# Altium schematic sheet CC2540.SchDoc
size A4
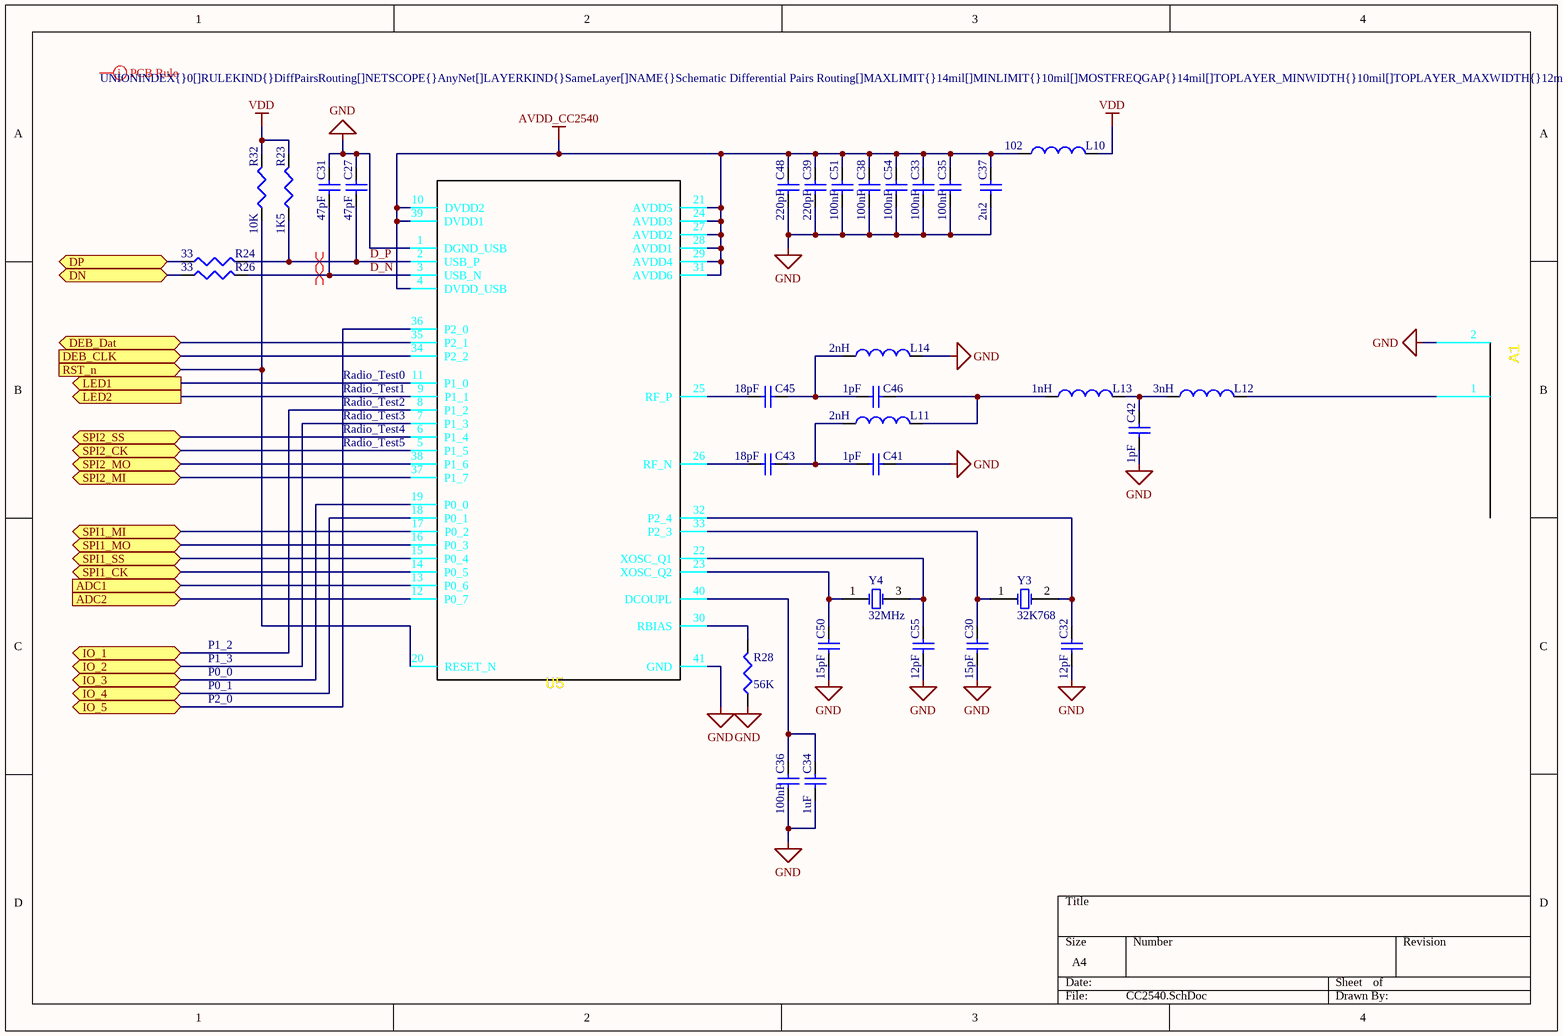
[diagram p0: CC2540.SchDoc]

## Parts
A1  Antenna_IIFA_1  [antenna_IIFA_1]  (value not drawn)
C27  value 47pF  [0402]  (hidden comment: Cap)
C30  value 15pF  [0402]  (hidden comment: Cap)
C31  value 47pF  [0402]  (hidden comment: Cap)
C32  value 12pF  [0402]  (hidden comment: Cap)
C33  value 100nF  [0402]  (hidden comment: Cap)
C34  value 1uF  [C0805]  (hidden comment: Cap)
C35  value 100nF  [0402]  (hidden comment: Cap)
C36  value 100nF  [0402]  (hidden comment: Cap)
C37  value 2u2  [C0805]  (hidden comment: Cap)
C38  value 100nF  [0402]  (hidden comment: Cap)
C39  value 220pF  [0402]  (hidden comment: Cap)
C41  value 1pF  [0402]  (hidden comment: Cap)
C42  value 1pF  [0402]  (hidden comment: Cap)
C43  value 18pF  [0402]  (hidden comment: Cap)
C45  value 18pF  [0402]  (hidden comment: Cap)
C46  value 1pF  [0402]  (hidden comment: Cap)
C48  value 220pF  [0402]  (hidden comment: Cap)
C50  value 15pF  [0402]  (hidden comment: Cap)
C51  value 100nF  [0402]  (hidden comment: Cap)
C54  value 100nF  [0402]  (hidden comment: Cap)
C55  value 12pF  [0402]  (hidden comment: Cap)
L10  value 102  [0402-A]  (hidden comment: Inductor)
L11  value 2nH  [0402-A]  (hidden comment: Inductor)
L12  value 3nH  [0402-A]  (hidden comment: Inductor)
L13  value 1nH  [0402-A]  (hidden comment: Inductor)
L14  value 2nH  [0402-A]  (hidden comment: Inductor)
R23  value 1K5  [J1-0603]  (hidden comment: Res3)
R24  value 33  [J1-0603]  (hidden comment: Res3)
R26  value 33  [J1-0603]  (hidden comment: Res3)
R28  value 56K  [J1-0603]  (hidden comment: Res3)
R32  value 10K  [J1-0603]  (hidden comment: Res3)
U5  CC2540  [QFN40_RHA (DATASHEET)]  (value not drawn)
Y3  32K768  [xtal_3215]
Y4  32MHz  [xtal_3225]

## Ports
ADC1 (in), ADC2 (in), DEB_CLK (in), DEB_Dat (bidir), DN (bidir), DP (bidir), IO_1 (bidir), IO_2 (bidir), IO_3 (bidir), IO_4 (bidir), IO_5 (bidir), LED1 (out), LED2 (out), RST_n (in), SPI1_CK (bidir), SPI1_MI (bidir), SPI1_MO (bidir), SPI1_SS (bidir), SPI2_CK (bidir), SPI2_MI (bidir), SPI2_MO (bidir), SPI2_SS (bidir)

## Nets
AVDD_CC2540: C33.2 C35.2 C37.2 C38.2 C39.2 C48.2 C51.2 C54.2 L10.1 U5.4(DVDD_USB) U5.10(DVDD2) U5.21(AVDD5) U5.24(AVDD3) U5.27(AVDD2) U5.28(AVDD1) U5.29(AVDD4) U5.31(AVDD6) U5.39(DVDD1)
GND: A1.2 C27.2 C30.1 C31.2 C32.1 C33.1 C34.1 C35.1 C36.1 C37.1 C38.1 C39.1 C41.1 C42.1 C48.1 C50.1 C51.1 C54.1 C55.1 L14.2 R28.1 U5.1(DGND_USB) U5.41(GND)
VDD: L10.2 R23.2 R32.2
ADC1: U5.13(P0_6) ; port ADC1
ADC2: U5.12(P0_7) ; port ADC2
D_N: C31.1 R26.2 U5.3(USB_N)
D_P: C27.1 R23.1 R24.2 U5.2(USB_P)
DEB_CLK: U5.34(P2_2) ; port DEB_CLK
DEB_Dat: U5.35(P2_1) ; port DEB_Dat
DN: R26.1 ; port DN
DP: R24.1 ; port DP
IO_1: U5.8(P1_2) ; port IO_1
IO_2: U5.7(P1_3) ; port IO_2
IO_3: U5.19(P0_0) ; port IO_3
IO_4: U5.18(P0_1) ; port IO_4
IO_5: U5.36(P2_0) ; port IO_5
LED1: U5.11(P1_0) ; port LED1
LED2: U5.9(P1_1) ; port LED2
RST_n: R32.1 U5.20(RESET_N) ; port RST_n
SPI1_CK: U5.14(P0_5) ; port SPI1_CK
SPI1_MI: U5.17(P0_2) ; port SPI1_MI
SPI1_MO: U5.16(P0_3) ; port SPI1_MO
SPI1_SS: U5.15(P0_4) ; port SPI1_SS
SPI2_CK: U5.5(P1_5) ; port SPI2_CK
SPI2_MI: U5.37(P1_7) ; port SPI2_MI
SPI2_MO: U5.38(P1_6) ; port SPI2_MO
SPI2_SS: U5.6(P1_4) ; port SPI2_SS
NetA1_1: A1.1 L12.2
NetC30_2: C30.2 U5.33(P2_3) Y3.1(OSC1)
NetC32_2: C32.2 U5.32(P2_4) Y3.2(OSC2)
NetC34_2: C34.2 C36.2 U5.40(DCOUPL)
NetC41_2: C41.2 C43.1 L11.1
NetC42_2: C42.2 L12.1 L13.2
NetC43_2: C43.2 U5.26(RF_N)
NetC45_1: C45.1 C46.2 L14.1
NetC45_2: C45.2 U5.25(RF_P)
NetC46_1: C46.1 L11.2 L13.1
NetC50_2: C50.2 U5.23(XOSC_Q2) Y4.1(OSC1)
NetC55_2: C55.2 U5.22(XOSC_Q1) Y4.3(OSC2)
NetR28_2: R28.2 U5.30(RBIAS)

## Layout directives
differential pair: D_N, D_P
rule Undefined; rule Differential Pairs Routing [Pref Gap = 14mil    Min Gap  = 10mil    Max Gap  = 14milPref Width = 12mil    Min Width  = 10mil    Max Width  = 12mil]: (no net found under the mark)

## Notes on the sheet
- (near U5) Radio_Test0
- (near U5) Radio_Test1
- (near U5) Radio_Test2
- (near U5) Radio_Test3
- (near U5) Radio_Test4
- (near U5) Radio_Test5
- P1_2
- P1_3
- P0_0
- P0_1
- P2_0

## Library data of the parts
A1 = Antenna_IIFA_1: Antenna single ended IIFA, 2450 MHz
C27 C31 = Cap: Capacitor; Manufacturer: FARNELL; RS: 624-2238; Order N: 1758959; Published: 8-Jun-2000; LatestRevisionDate: 17-Jul-2002; LatestRevisionNote: Re-released for DXP Platform.; PackageReference: RAD-0.3; Publisher: Altium Limited; PackageDescription: Radial Cap, Thru-Hole; 2 Leads; 0.3 in Pin Spacing; FARNELL: 1758959
C30 C50 = Cap: Capacitor; Manufacturer: FARNELL; RS: 788-0266; Order N: 2218840; Published: 8-Jun-2000; LatestRevisionDate: 17-Jul-2002; LatestRevisionNote: Re-released for DXP Platform.; PackageReference: RAD-0.3; Publisher: Altium Limited; PackageDescription: Radial Cap, Thru-Hole; 2 Leads; 0.3 in Pin Spacing; FARNELL: 2218840
C32 C55 = Cap: Capacitor; Manufacturer: FARNELL; RS: 788-0263; Order N: 2210762; Published: 8-Jun-2000; LatestRevisionDate: 17-Jul-2002; LatestRevisionNote: Re-released for DXP Platform.; PackageReference: RAD-0.3; Publisher: Altium Limited; PackageDescription: Radial Cap, Thru-Hole; 2 Leads; 0.3 in Pin Spacing; FARNELL: 2210762
C33 C35 C36 C38 C51 C54 = Cap: Capacitor; Manufacturer: FARNELL; RS: 788-2843; Order N: 2309011; Published: 8-Jun-2000; LatestRevisionDate: 17-Jul-2002; LatestRevisionNote: Re-released for DXP Platform.; PackageReference: RAD-0.3; Publisher: Altium Limited; PackageDescription: Radial Cap, Thru-Hole; 2 Leads; 0.3 in Pin Spacing; FARNELL: 2309011
C34 = Cap: Capacitor; Manufacturer: FARNELL; RS: 653-0490; Order N: 2320857; Published: 8-Jun-2000; LatestRevisionDate: 17-Jul-2002; LatestRevisionNote: Re-released for DXP Platform.; PackageReference: RAD-0.3; Publisher: Altium Limited; PackageDescription: Radial Cap, Thru-Hole; 2 Leads; 0.3 in Pin Spacing; FARNELL: 2320857
C37 = Cap: Capacitor; Manufacturer: FARNELL; RS: 749-2138; Order N: 1759416; Published: 8-Jun-2000; LatestRevisionDate: 17-Jul-2002; LatestRevisionNote: Re-released for DXP Platform.; PackageReference: RAD-0.3; Publisher: Altium Limited; PackageDescription: Radial Cap, Thru-Hole; 2 Leads; 0.3 in Pin Spacing; FARNELL: 1759416
C39 C48 = Cap: Capacitor; Manufacturer: FARNELL; RS: 624-2941; Order N: 2426879; Published: 8-Jun-2000; LatestRevisionDate: 17-Jul-2002; LatestRevisionNote: Re-released for DXP Platform.; PackageReference: RAD-0.3; Publisher: Altium Limited; PackageDescription: Radial Cap, Thru-Hole; 2 Leads; 0.3 in Pin Spacing; FARNELL: 2426879
C41 C42 C46 = Cap: Capacitor; Manufacturer: FARNELL; RS: 788-0279; Order N: 1611944; Published: 8-Jun-2000; LatestRevisionDate: 17-Jul-2002; LatestRevisionNote: Re-released for DXP Platform.; PackageReference: RAD-0.3; Publisher: Altium Limited; PackageDescription: Radial Cap, Thru-Hole; 2 Leads; 0.3 in Pin Spacing; FARNELL: 1611944
C43 C45 = Cap: Capacitor; Manufacturer: FARNELL; RS: 788-0260; Order N: 1758947; Published: 8-Jun-2000; LatestRevisionDate: 17-Jul-2002; LatestRevisionNote: Re-released for DXP Platform.; PackageReference: RAD-0.3; Publisher: Altium Limited; PackageDescription: Radial Cap, Thru-Hole; 2 Leads; 0.3 in Pin Spacing; FARNELL: 1758947
L10 L13 = Inductor: Manufacturer: FARNELL; Code_IEC: 1005; RS: 777-6861; Order N: 1669624; Published: 8-Jun-2000; LatestRevisionDate: 29-May-2009; LatestRevisionNote: IPC-7351 Footprint Added.; PackageReference: 0402-A; Publisher: Altium Limited; PackageDescription: Chip Inductor; Code_JEITA: 0402; FARNELL: 1669624
L11 L14 = Inductor: Manufacturer: FARNELL; Code_IEC: 1005; RS: 777-6978; Order N: 2103067; Published: 8-Jun-2000; LatestRevisionDate: 29-May-2009; LatestRevisionNote: IPC-7351 Footprint Added.; PackageReference: 0402-A; Publisher: Altium Limited; PackageDescription: Chip Inductor; Code_JEITA: 0402; FARNELL: 2103067
L12 = Inductor: Manufacturer: FARNELL; Code_IEC: 1005; RS: 777-6987; Order N: 2103077; Published: 8-Jun-2000; LatestRevisionDate: 29-May-2009; LatestRevisionNote: IPC-7351 Footprint Added.; PackageReference: 0402-A; Publisher: Altium Limited; PackageDescription: Chip Inductor; Code_JEITA: 0402; FARNELL: 2103077
R23 = Res3: Resistor; Manufacturer: FARNELL; RS: N.E.; Order N: 2331729; Published: 8-Jun-2000; LatestRevisionDate: 29-May-2009; LatestRevisionNote: IPC-7351 Footprint Added.; PackageReference: J1-0603; Publisher: Altium Limited; PackageDescription: Chip Resistor; FARNELL: 2331729
R24 R26 = Res3: Resistor; Manufacturer: FARNELL; RS: 721-7227; Order N: 2331705; Published: 8-Jun-2000; LatestRevisionDate: 29-May-2009; LatestRevisionNote: IPC-7351 Footprint Added.; PackageReference: J1-0603; Publisher: Altium Limited; PackageDescription: Chip Resistor; FARNELL: 2331705
R28 = Res3: Resistor; Manufacturer: FARNELL; RS: N.E.; Order N: 2331750; Published: 8-Jun-2000; LatestRevisionDate: 29-May-2009; LatestRevisionNote: IPC-7351 Footprint Added.; PackageReference: J1-0603; Publisher: Altium Limited; PackageDescription: Chip Resistor; FARNELL: 2331750
R32 = Res3: Resistor; Manufacturer: FARNELL; RS: N.E.; Order N: 2333520; Published: 8-Jun-2000; LatestRevisionDate: 29-May-2009; LatestRevisionNote: IPC-7351 Footprint Added.; PackageReference: J1-0603; Publisher: Altium Limited; PackageDescription: Chip Resistor; FARNELL: 2333520
U5 = CC2540: Single chip BLE; Manufacturer: FARNELL; RS: 730-0534; PN: CC2540F256RHAT; Order N: 1862837RL; FARNELL: 1862837RL
Y3 = XTAL: Crystal Oscillator; Manufacturer: Smart Prototyping; SP: SP-C14473; Value: 32.768KHz; FARNELL: 2449398; Order N: SP-C14473
Y4 = XTAL_4: Crystal Oscillator; Manufacturer: Smart Prototyping; SP: SP-C9009; RS: *; FARNELL: 1842072; Value: 32MHz; Order N: SP-C9009